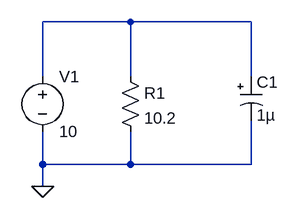
[diagram p0: schematic DESCRIPTION_ERROR.asc]
DESCRIPTION_ERROR.asc, the LTspice schematic file:
Version 4
SHEET 1 880 680
WIRE 320 16 192 16
WIRE 496 16 320 16
WIRE 192 96 192 16
WIRE 320 96 320 16
WIRE 496 96 496 16
WIRE 192 224 192 176
WIRE 320 224 320 176
WIRE 320 224 192 224
WIRE 496 224 496 160
WIRE 496 224 320 224
WIRE 192 256 192 224
FLAG 192 256 0
SYMBOL voltage 192 80 R0
WINDOW 123 0 0 Left 0
WINDOW 39 0 0 Left 0
SYMATTR InstName V1
SYMATTR Value 10
SYMBOL res 304 80 R0
SYMATTR InstName R1
SYMATTR Value 10.2
SYMATTR SpiceLine tol=1 pwr=0.1
SYMBOL polcap 480 96 R0
WINDOW 3 24 56 Left 2
SYMATTR InstName C1
SYMATTR Value 1µ
SYMATTR Description Diode
SYMATTR Type cap
SYMATTR SpiceLine V=16 Irms=0 Rser=11 Lser=0 mfg="AVX" pn="TAJA105K016" type="Tantalum"

The netlist it stands for:
* DESCRIPTION_ERROR.asc
V1 N001 0 10
R1 N001 0 10.2 tol=1 pwr=0.1
C1 N001 0 1µ V=16 Irms=0 Rser=11 Lser=0 mfg="AVX" pn="TAJA105K016" type="Tantalum"
.backanno
.end